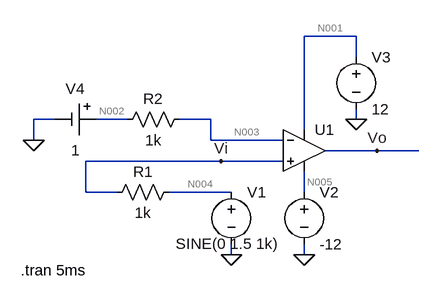
[diagram p0: schematic ni_c.asc]
ni_c.asc, the LTspice schematic file:
Version 4
SHEET 1 880 680
WIRE 288 -16 208 -16
WIRE 288 16 288 -16
WIRE -176 112 -208 112
WIRE -64 112 -112 112
WIRE 64 112 16 112
WIRE 288 112 288 96
WIRE 208 128 208 -16
WIRE -208 144 -208 112
WIRE 64 144 64 112
WIRE 176 144 64 144
WIRE 320 160 240 160
WIRE 384 160 320 160
WIRE 80 176 -128 176
WIRE 176 176 80 176
WIRE -128 224 -128 176
WIRE -80 224 -128 224
WIRE 96 224 0 224
WIRE 208 224 208 192
WIRE 96 320 96 304
WIRE 208 320 208 304
FLAG 288 112 0
FLAG 208 320 0
FLAG 96 320 0
FLAG -208 144 0
FLAG 320 160 Vo
FLAG 80 176 Vi
SYMBOL Opamps\\UniversalOpamp2 208 160 R0
SYMATTR InstName U1
SYMBOL voltage 96 208 R0
WINDOW 3 -86 95 Left 2
WINDOW 123 0 0 Left 0
WINDOW 39 0 0 Left 0
SYMATTR InstName V1
SYMATTR Value SINE(0 1.5 1k)
SYMBOL voltage 208 208 R0
WINDOW 123 0 0 Left 0
WINDOW 39 0 0 Left 0
SYMATTR InstName V2
SYMATTR Value -12
SYMBOL voltage 288 0 R0
WINDOW 123 0 0 Left 0
WINDOW 39 0 0 Left 0
SYMATTR InstName V3
SYMATTR Value 12
SYMBOL res 16 208 R90
WINDOW 0 0 56 VBottom 2
WINDOW 3 32 56 VTop 2
SYMATTR InstName R1
SYMATTR Value 1k
SYMBOL res 32 96 R90
WINDOW 0 0 56 VBottom 2
WINDOW 3 32 56 VTop 2
SYMATTR InstName R2
SYMATTR Value 1k
SYMBOL Misc\\cell -112 112 R90
WINDOW 0 -32 32 VBottom 2
WINDOW 3 32 32 VTop 2
WINDOW 123 0 0 Left 0
WINDOW 39 0 0 Left 0
SYMATTR InstName V4
SYMATTR Value 1
TEXT -228 344 Left 2 !.tran 5ms

The netlist it stands for:
* ni_c.asc
XU1 Vi N003 N001 N005 Vo level.2 Avol=1Meg GBW=10Meg Slew=10Meg ilimit=25m rail=0 Vos=0 phimargin=45 en=0 enk=0 in=0 ink=0 Rin=500Meg  ; pins IN+ IN- V+ V- OUT
V1 N004 0 SINE(0 1.5 1k)
V2 N005 0 -12
V3 N001 0 12
R1 N004 Vi 1k
R2 N003 N002 1k
V4 N002 0 1
.tran 5ms
.lib UniversalOpamps2.sub
.backanno
.end

* Results of the author's LTspice run, read from the files saved beside the schematic
* Operating Point, zero values left out:
*   V(vo) = -12 V
*   V(n001) = 12 V
*   V(n005) = -12 V
*   V(n003) = 1 V
*   V(n002) = 1 V
*   I(R2) = -2 nA
*   I(V4) = -2 nA
*   I(V3) = -2.789 µA
*   I(V2) = 2.621 µA
*   Ix(u1:2) = 2 nA
*   Ix(u1:3) = 2.789 µA
*   Ix(u1:4) = -2.621 µA
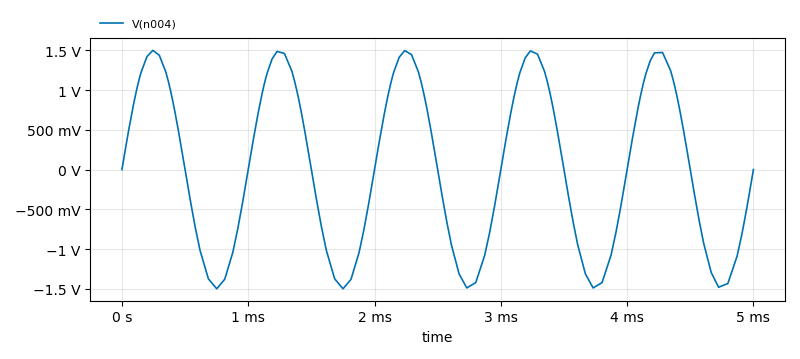
[diagram p1: Transient Analysis of ni_c.asc, plotted from the saved traces]
* Transient Analysis, 1 run:
*   V(n004): min -1.5 V, max 1.499 V, average 3.072 mV, rms 1.054 V, last 0 V